# Altium schematic sheet Mainboard.SchDoc
size A3
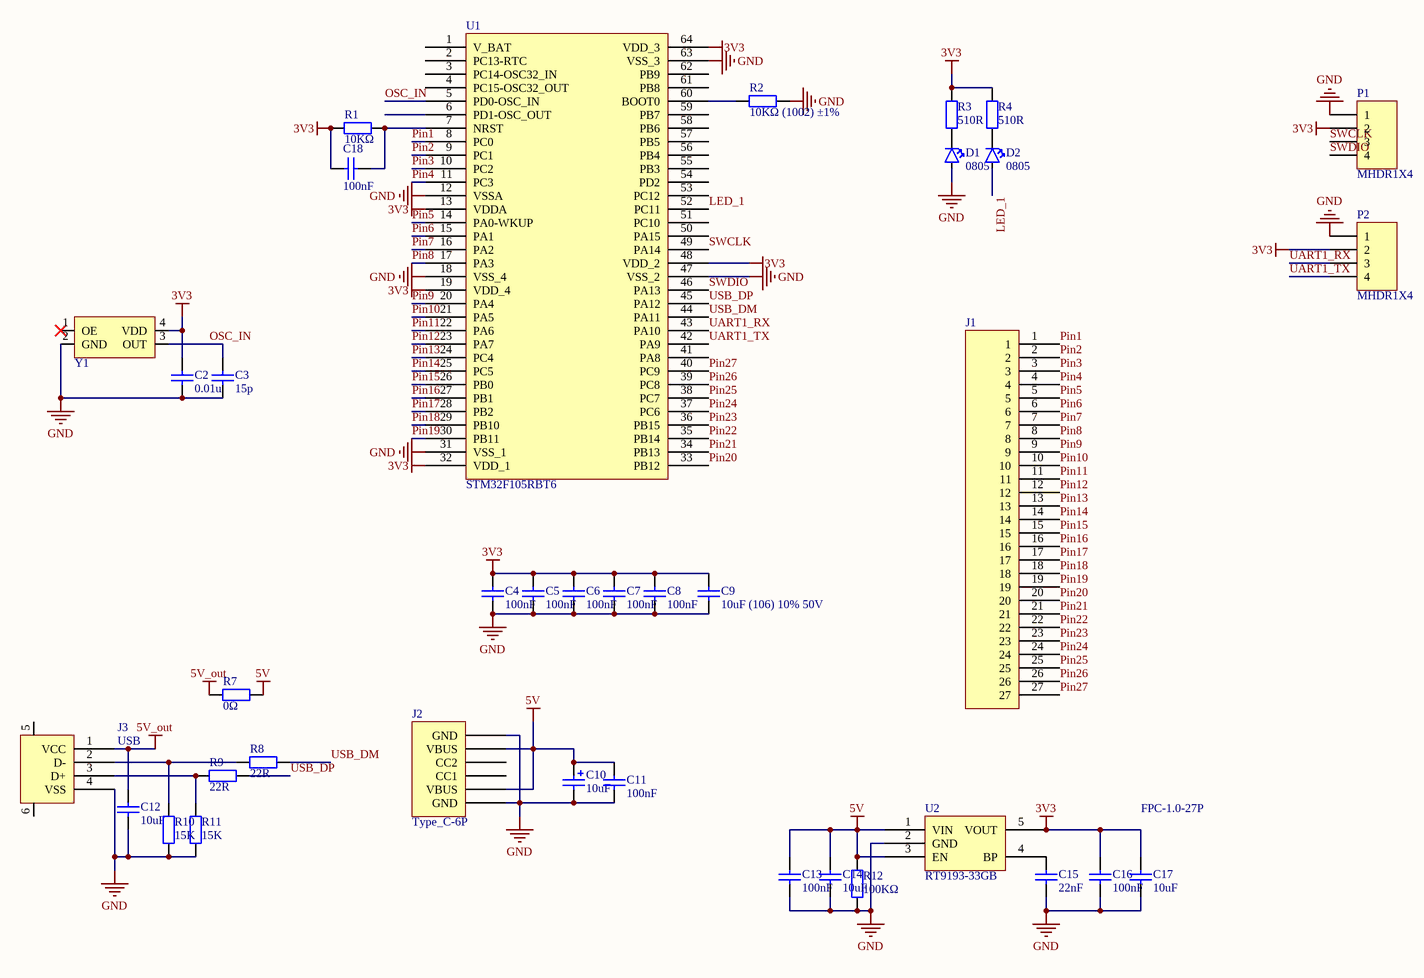
[diagram p0: Mainboard.SchDoc]

## Parts
C2  0.01u  [0603_C]
C3  15p  [0603_C]
C4  100nF  [0603_C]
C5  100nF  [0603_C]
C6  100nF  [0603_C]
C7  100nF  [0603_C]
C8  100nF  [0603_C]
C9  10uF (106) 10% 50V  [1206_C]
C10  10uF  [CASE-A_3216]
C11  100nF  [0603_C]
C12  10uF  [1206_C]
C13  100nF  [0603_C]
C14  10uF  [1206_C]
C15  22nF  [0603_C]
C16  100nF  [0603_C]
C17  10uF  [1206_C]
C18  100nF  [0603_C]
D1  0805  [0805-LED]
D2  0805  [0805-LED]
J1  FPC-1.0-27P  [FPC-1.0-27P]
J2  Type_C-6P  [Type_C-6P]
J3  USB  [USB_A1]
P1  MHDR1X4  [MHDR1X4]
P2  MHDR1X4  [MHDR1X4]
R1  10KΩ  [0603_R]
R2  10KΩ (1002) ±1%  [0603_R]
R3  510R  [0603_R]
R4  510R  [0603_R]
R7  0Ω  [0603_R]
R8  22R  [0603_R]
R9  22R  [0603_R]
R10  15K  [0603_R]
R11  15K  [0603_R]
R12  100KΩ  [0603_R]
U1  STM32F105RBT6  [LQFP-64_10x10x05P]
U2  RT9193-33GB  [SOT23-5]
Y1  XATLS  [XTAL-3225]  (value not drawn)

## Nets
3V3: C2.2 C4.2 C5.2 C6.2 C7.2 C8.2 C9.2 C16.2 C17.2 C18.2 P1.2 P2.2 R1.2 R3.2 R4.2 U1.13(VDDA) U1.19(VDD_4) U1.32(VDD_1) U1.48(VDD_2) U1.64(VDD_3) U2.5(VOUT) Y1.4(VDD)
5V: C10.1 C11.2 C13.2 C14.2 J2.A9(VBUS) J2.B9(VBUS) R7.2 R12.1 U2.1(VIN) U2.3(EN)
5V_out: C12.2 J3.1(VCC) R7.1
GND: C2.1 C3.1 C4.1 C5.1 C6.1 C7.1 C8.1 C9.1 C10.2 C11.1 C12.1 C13.1 C14.1 C15.1 C16.1 C17.1 D1.2 J2.A12(GND) J2.B12(GND) J3.4(VSS) P1.1 P2.1 R2.2 R10.2 R11.2 R12.2 U1.12(VSSA) U1.18(VSS_4) U1.31(VSS_1) U1.47(VSS_2) U1.63(VSS_3) U2.2(GND) Y1.2(GND)
LED_1: D2.2 U1.52(PC11)
OSC_IN: C3.2 U1.5(PD0-OSC_IN) Y1.3(OUT)
Pin1: J1.1 U1.8(PC0)
Pin2: J1.2 U1.9(PC1)
Pin3: J1.3 U1.10(PC2)
Pin4: J1.4 U1.11(PC3)
Pin5: J1.5 U1.14(PA0-WKUP)
Pin6: J1.6 U1.15(PA1)
Pin7: J1.7 U1.16(PA2)
Pin8: J1.8 U1.17(PA3)
Pin9: J1.9 U1.20(PA4)
Pin10: J1.10 U1.21(PA5)
Pin11: J1.11 U1.22(PA6)
Pin12: J1.12 U1.23(PA7)
Pin13: J1.13 U1.24(PC4)
Pin14: J1.14 U1.25(PC5)
Pin15: J1.15 U1.26(PB0)
Pin16: J1.16 U1.27(PB1)
Pin17: J1.17 U1.28(PB2)
Pin18: J1.18 U1.29(PB10)
Pin19: J1.19 U1.30(PB11)
Pin20: J1.20 U1.33(PB12)
Pin21: J1.21 U1.34(PB13)
Pin22: J1.22 U1.35(PB14)
Pin23: J1.23 U1.36(PB15)
Pin24: J1.24 U1.37(PC6)
Pin25: J1.25 U1.38(PC7)
Pin26: J1.26 U1.39(PC8)
Pin27: J1.27 U1.40(PC9)
SWCLK: P1.3 U1.49(PA14)
SWDIO: P1.4 U1.46(PA13)
UART1_RX: P2.3 U1.43(PA10)
UART1_TX: P2.4 U1.42(PA9)
USB_DM: R8.1 U1.44(PA11)
USB_DP: R9.1 U1.45(PA12)
NetC15_2: C15.2 U2.4(BP)
NetC18_1: C18.1 R1.1 U1.7(NRST)
NetD1_1: D1.1 R3.1
NetD2_1: D2.1 R4.1
NetJ3_2: J3.2(D-) R8.2 R10.1
NetJ3_3: J3.3(D+) R9.2 R11.1
NetR2_1: R2.1 U1.60(BOOT0)

Not connected (* = marked no-connect by the designer): J2 A5(CC1) B5(CC2); J3 5 6; U1 1(V_BAT) 2(PC13-RTC) 3(PC14-OSC32_IN) 4(PC15-OSC32_OUT) 6(PD1-OSC_OUT) 41(PA8) 50(PA15) 51(PC10) 53(PC12) 54(PD2) 55(PB3) 56(PB4) 57(PB5) 58(PB6) 59(PB7) 61(PB8) 62(PB9); Y1 1(OE)*

## Library data of the parts
C2-C8 C11 C13 C15 C16 C18 = 0603 100nF (104) 10% 50V: 贴片电容; ComponentLink1Description: 供应商链接; ComponentLink1URL: http://www.szlcsc.com/product/details_15331.html; Package: 0603; Supplier: LC; SuppliersPartNumber: C14663
C9 C12 C14 C17 = 1206 10uF (106) 10% 50V: 贴片电容; ComponentLink1Description: 供应商链接; ComponentLink1URL: http://www.szlcsc.com/product/details_14236.html; Package: 1206; Supplier: LC; SuppliersPartNumber: C13585
C10 = 3216 10uF (106) 10% 16V: 钽电容; ComponentLink1Description: 供应商链接; ComponentLink1URL: http://www.szlcsc.com/product/details_7643.html; Package: 3216; Supplier: LC; SuppliersPartNumber: C7171
D1 D2 = LED0805
J3 = USB: USB接口
P1 P2 = MHDR1X4: Header, 4-Pin; LatestRevisionDate: 17-Jul-2002; LatestRevisionNote: Re-released for DXP Platform.; Publisher: Altium Limited
R1-R4 R8-R11 = 0603 10KΩ (1002) 1%: 贴片电阻; ComponentLink1Description: 供应商链接; ComponentLink1URL: http://www.szlcsc.com/product/details_26547.html; Package: 0603; Supplier: LC; SuppliersPartNumber: C25804
R7 = 0603 0Ω (0R0) 1%: 贴片电阻; ComponentLink1Description: 供应商链接; ComponentLink1URL: http://www.szlcsc.com/product/details_21903.html; Package: 0603; Supplier: LC; SuppliersPartNumber: C21189
R12 = 0603 100KΩ (1003) 1%: 贴片电阻; ComponentLink1Description: 供应商链接; ComponentLink1URL: http://www.szlcsc.com/product/details_26546.html; Package: 0603; Supplier: LC; SuppliersPartNumber: C25803
Y1 = XATLS: 贴片有源晶振